# EasyEDA schematic SCH_ASTRA-Unit00_2024-12-20.json
TITLE: ASTRA_Unit_00 Prototype; REV: 6.9; Date: 2024-10-18; Sheet: 1/1; Drawn By: Mahadi Sajjad Neloy; Company: Project ASTRA | Youth Notion
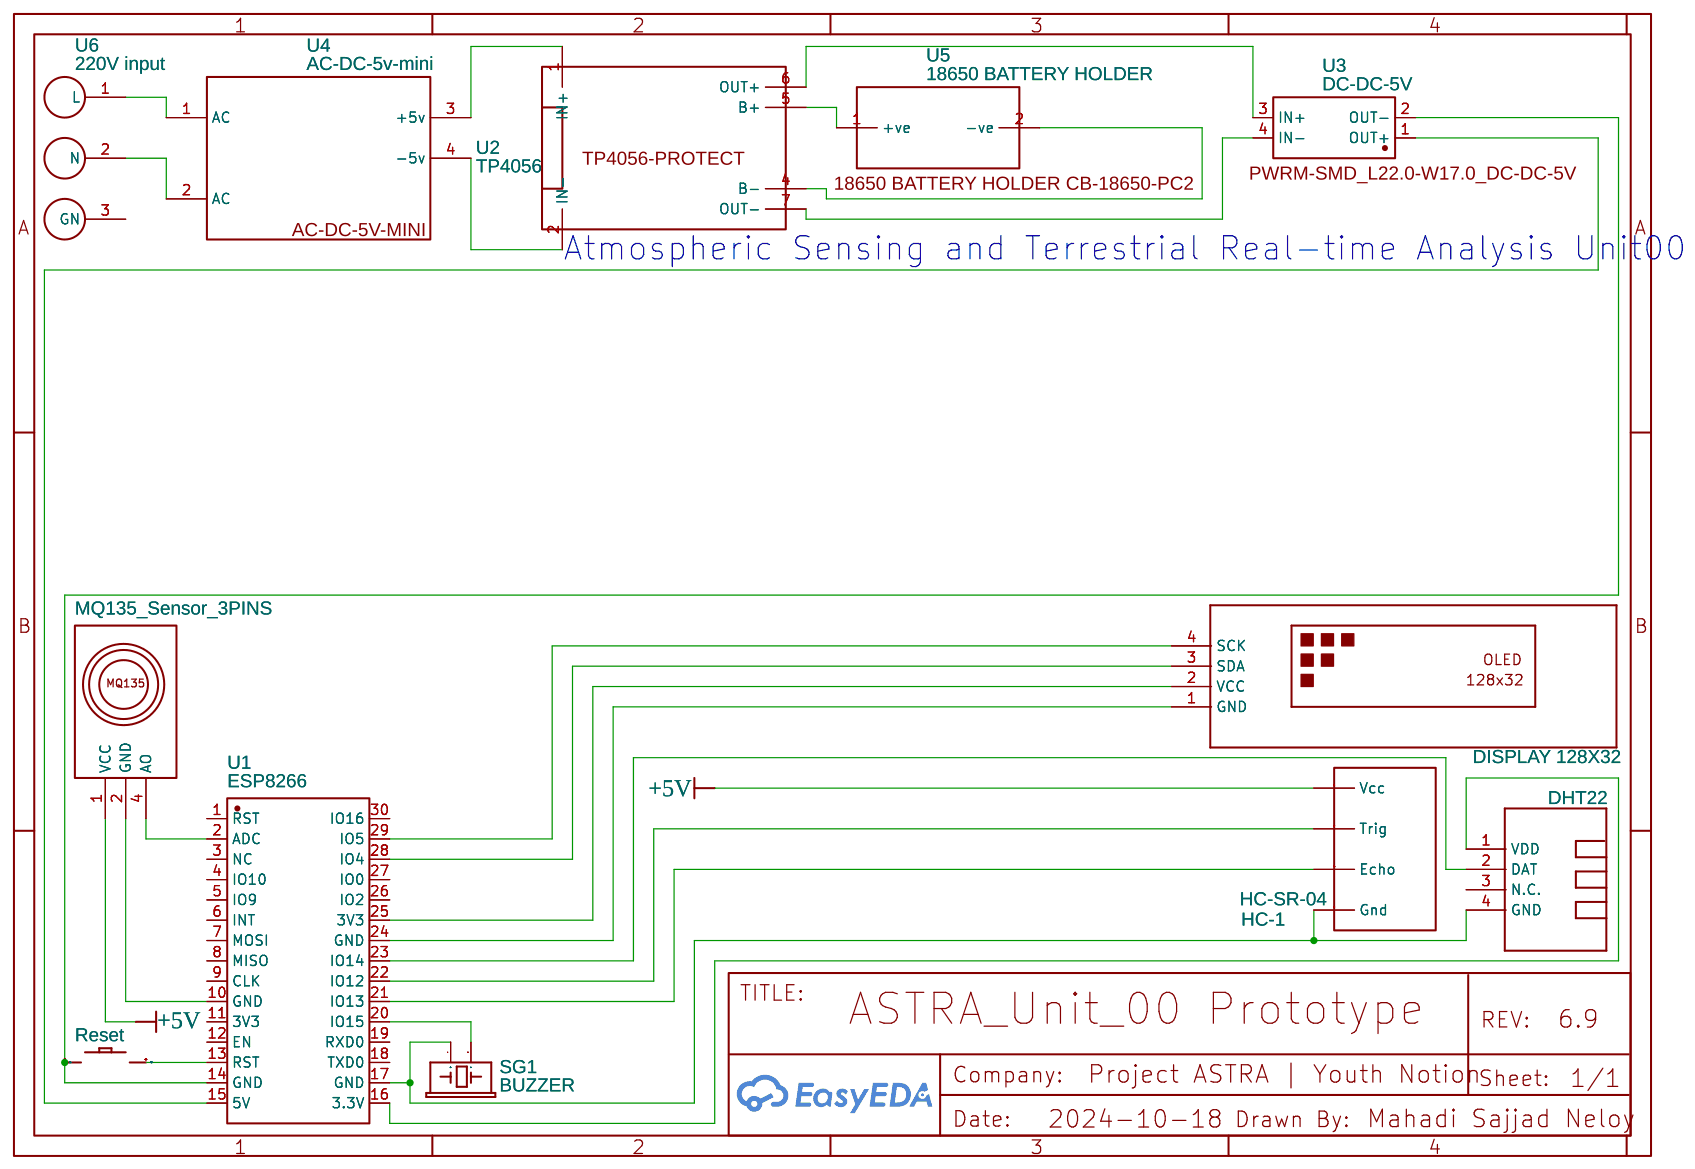
[diagram p0: schematic sheet]

## Parts
1  DISPLAY 128X32  [DISPLAY-OLED-128X32]
2  DHT22  [TEMP-HUM-SENSOR-DHT22]
3  Reset  [32TEETH---CONDUCTIVE-BUTTONS_CONDUCTIVE_BUTTON_DIRECTIONAL_THICK]
HC-1  HC-SR-04  [HC-04]
SG1  BUZZER  [BUZZER-12MM-KIT]
U1  ESP8266  [WIFIM-TH_NODEMCU-8266]
U2  TP4056  [TP4056-PROTECT]
U3  DC-DC-5V  [PWRM-SMD_L22.0-W17.0_DC-DC-5V]
U4  AC-DC-5v-mini  [AC-DC-5V-MINI]
U5  18650 BATTERY HOLDER  [18650 BATTERY HOLDER CB-18650-PC2]
U6  220V input  [220V INPUT]
U7  MQ135_Sensor_3PINS  [MQ135_MODULO]

## Library data of the parts
1 = DISPLAY-OLED-128X32: Contributor: Neeraj Aggarwal; Package Display: No
2 = TEMP-HUM-SENSOR-DHT22: Contributor: Koushik1111; Package Display: No
3 = button: Contributor: dipaolo.1882662; Package Display: No
HC-1 = HC-SR-04: Contributor: Malov999; Package Display: No
SG1 = BUZZER: Contributor: Daniil-Shteud; Package Display: No
U1 = NODEMCU(12F): Supplier: LCSC; Supplier Part: C2764098; Manufacturer: Ai-Thinker(安信可); Contributor: lcsc; JLCPCB Part Class: Extended Part; Package Display: No
U2 = TP4056: Manufacturer Part: TP4056-protect; link: https://dlnmh9ip6v2uc.cloudfront.net/datasheets/Prototyping/TP4056.pdf; Contributor: James Martin; Package Display: Yes
U3 = DC-DC-5V: Contributor: LCSC; Supplier: LCSC; Supplier Part: C9900001346; JLCPCB Part Class: Extended Part; Manufacturer: null; Package Display: Yes
U4 = AC-DC-5v-mini: Contributor: Prim_2006; Package Display: Yes
U5 = 18650 BATTERY HOLDER CB-18650-PC2 _NOTEMP COPY: Contributor: wjya _rcr; Package Display: Yes
U6 = 220V input: Contributor: paulenaz690; Package Display: No
U7 = MQ135_Sensor_3PINS: Contributor: Frederico A; Package Display: No

## Nets
+5V: HC-1.VCC(Vcc) U7.1(VCC)
Net-(1-1): 1.1(GND) U1.24(GND)
Net-(1-2): 1.2(VCC) U1.25(3V3)
Net-(1-3): 1.3(SDA) U1.28(IO4)
Net-(1-4): 1.4(SCK) U1.29(IO5)
Net-(2-1): 2.1(VDD) U1.16(3.3V)
Net-(2-2): 2.2(DAT) U1.23(IO14)
Net-(2-4): 2.4(GND) HC-1.GND(Gnd) SG1.-(2) U1.17(GND)
Net-(3-P$ACTIVE): 3.P$ACTIVE U1.13(RST)
Net-(3-P$GND): 3.P$GND U1.14(GND) U3.2(OUT-)
Net-(HC-1-ECHO): HC-1.ECHO(Echo) U1.21(IO13)
Net-(HC-1-TRIG): HC-1.TRIG(Trig) U1.22(IO12)
Net-(SG1-+): SG1.+(1) U1.20(IO15)
Net-(U1-2): U1.2(ADC) U7.4(AO)
Net-(U1-10): U1.10(GND) U7.2(GND)
Net-(U1-15): U1.15(5V) U3.1(OUT+)
Net-(U2-1): U2.1(IN+) U4.3(+5v)
Net-(U2-2): U2.2(IN-) U4.4(-5v)
Net-(U2-4): U2.4(B-) U5.2(-ve)
Net-(U2-5): U2.5(B+) U5.1(+ve)
Net-(U2-6): U2.6(OUT+) U3.3(IN+)
Net-(U2-7): U2.7(OUT-) U3.4(IN-)
Net-(U4-1): U4.1(AC) U6.1(L)
Net-(U4-2): U4.2(AC) U6.2(N)

Not connected (* = marked no-connect by the designer): 2 3(N.C.); U1 1(RST) 3(NC) 4(IO10) 5(IO9) 6(INT) 7(MOSI) 8(MISO) 9(CLK) 11(3V3) 12(EN) 18(TXD0) 19(RXD0) 26(IO2) 27(IO0) 30(IO16); U6 3(GN)

## Notes on the sheet
- Atmospheric Sensing and Terrestrial Real-time Analysis Unit00
